# EAGLE schematic Propeller_Development_Slab (EAGLE 6.6.0)
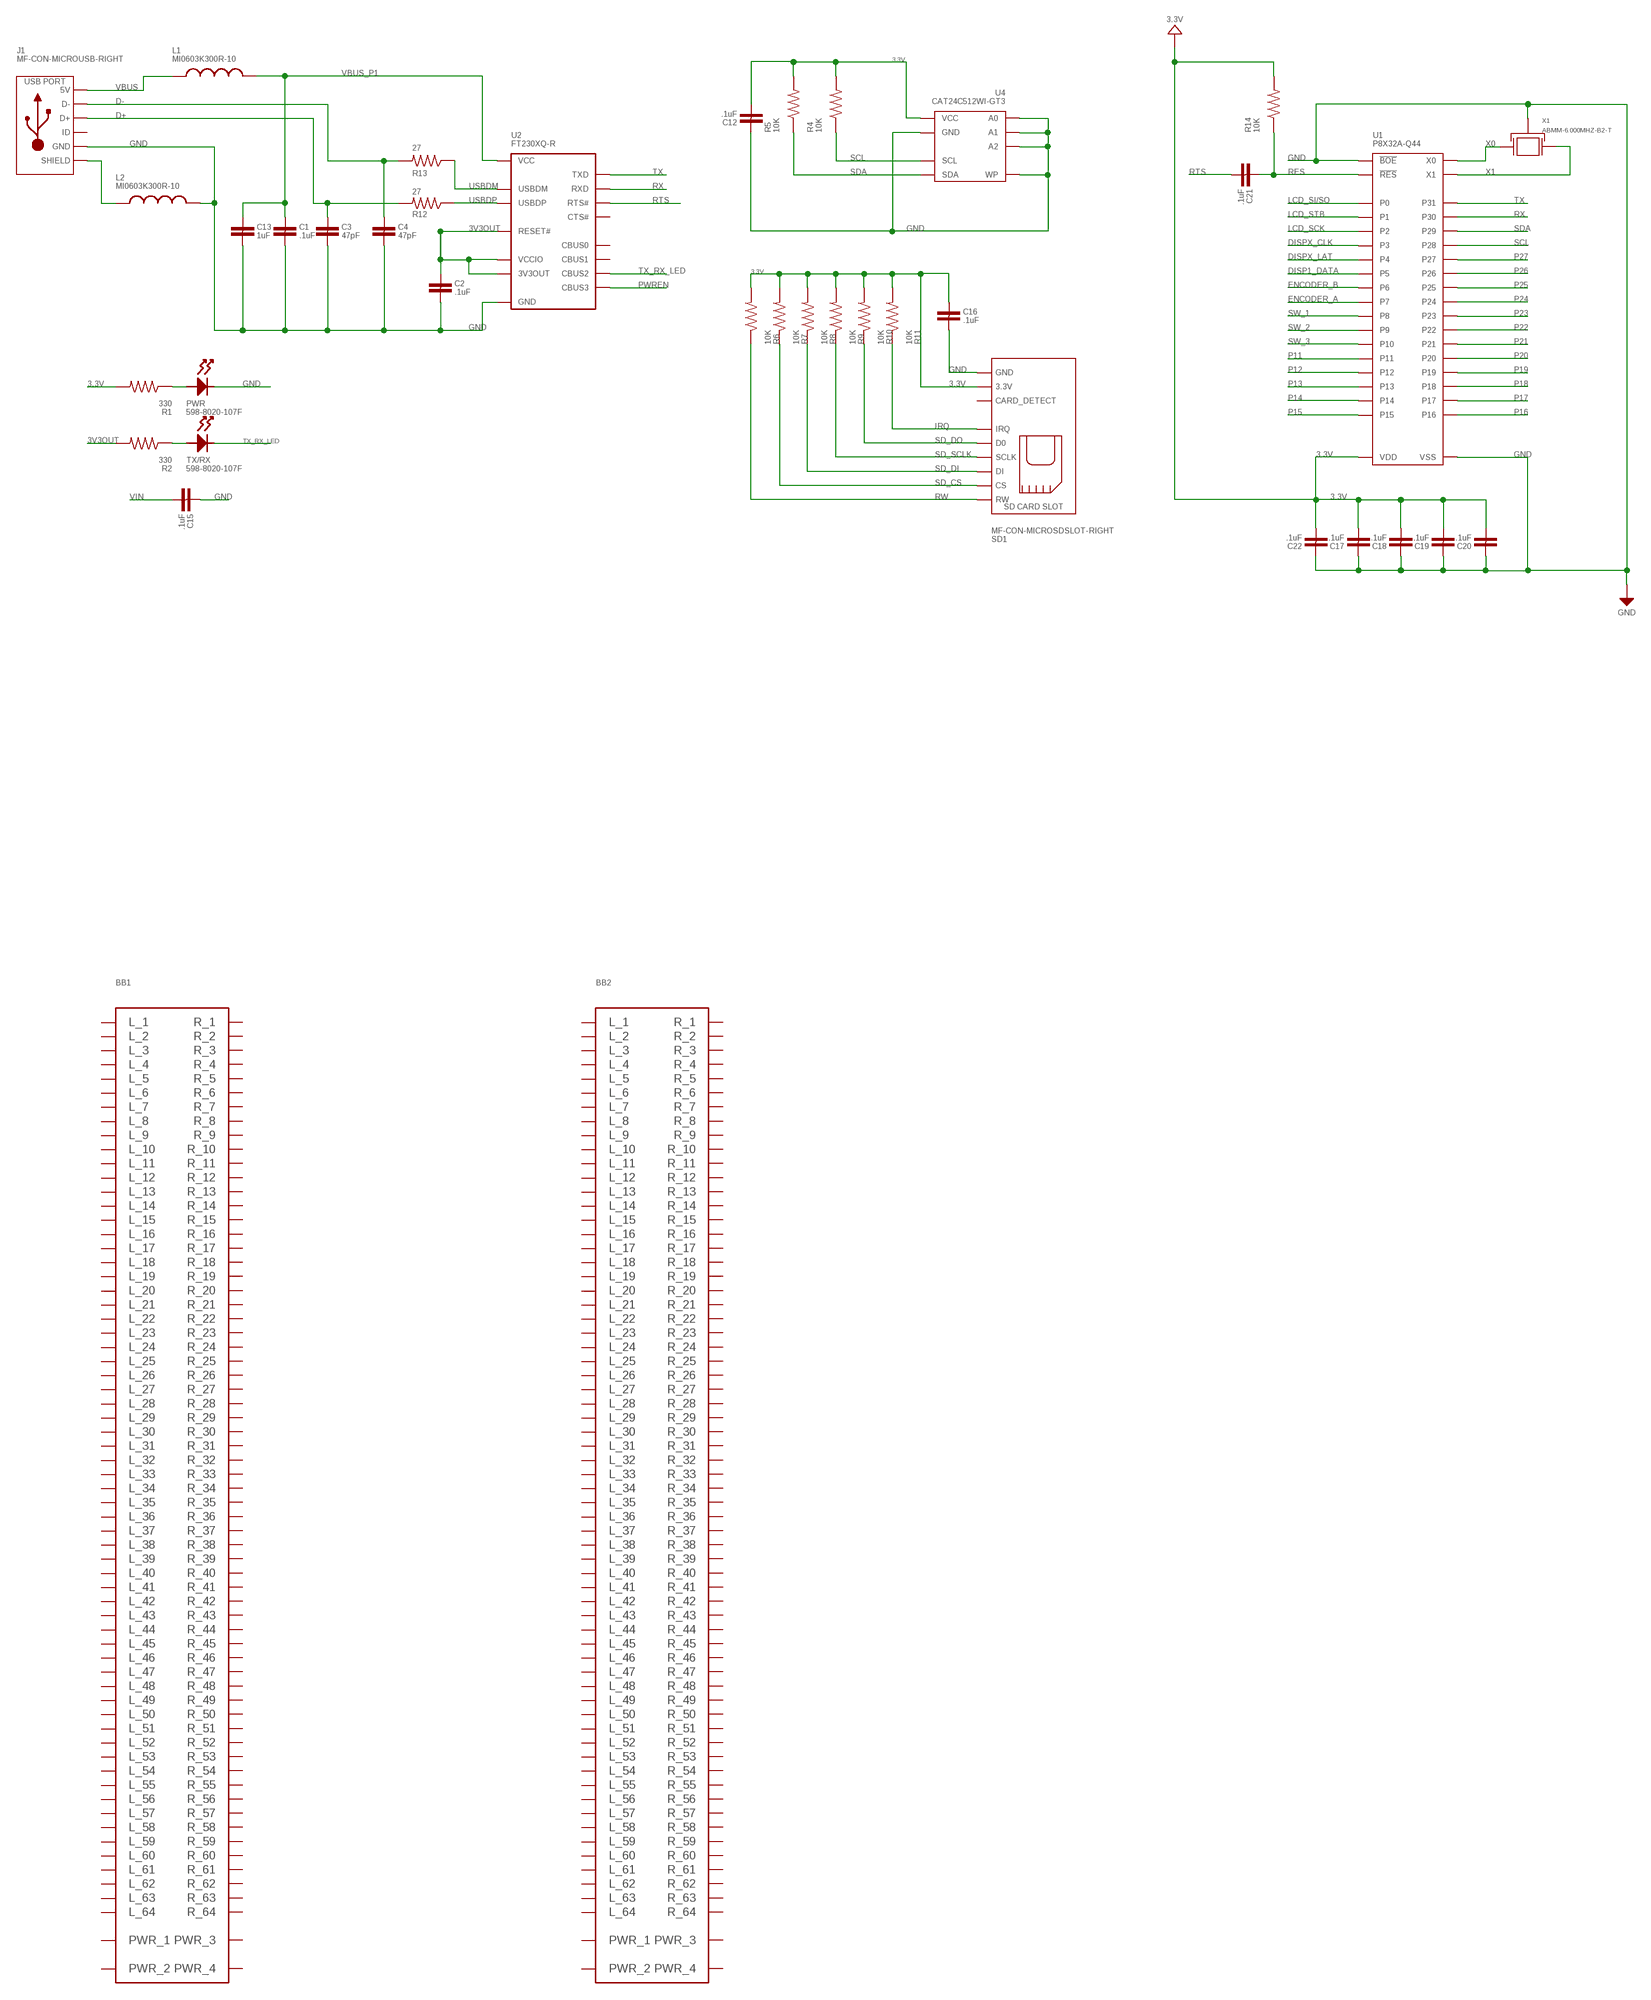
[diagram p0: schematic, sheet 1]

## Parts
BB1  BREADBOARD_0165-4214-7-9010  [0165-4214-7-9010]
BB2  BREADBOARD_0165-4214-7-9010  [0165-4214-7-9010]
C1  .1uF  CAPACITOR_NON_POLAR_0805  [0805]
C2  .1uF  CAPACITOR_NON_POLAR_0805  [0805]
C3  47pF  CAPACITOR_NON_POLAR_0805  [0805]
C4  47pF  CAPACITOR_NON_POLAR_0805  [0805]
C12  .1uF  CAPACITOR_NON_POLAR_0805  [0805]
C13  1uF  CAPACITOR_NON_POLAR_0805  [0805]
C15  .1uF  CAPACITOR_NON_POLAR_0805  [0805]
C16  .1uF  CAPACITOR_NON_POLAR_0805  [0805]
C17  .1uF  CAPACITOR_NON_POLAR_0805  [0805]
C18  .1uF  CAPACITOR_NON_POLAR_0805  [0805]
C19  .1uF  CAPACITOR_NON_POLAR_0805  [0805]
C20  .1uF  CAPACITOR_NON_POLAR_0805  [0805]
C21  .1uF  CAPACITOR_NON_POLAR_0805  [0805]
C22  .1uF  CAPACITOR_NON_POLAR_0805  [0805]
J1  MF-CON-MICROUSB-RIGHT  USB_MICRO_RIGHT  [MICROUSB-RIGHT]
L1  MI0603K300R-10  INDUCTOR_0603  [0603]
L2  MI0603K300R-10  INDUCTOR_0603  [0603]
PWR  598-8020-107F  LED_SINGLE_0805  [LED_0805]
R1  330  RESISTOR_0805  [0805]
R2  330  RESISTOR_0805  [0805]
R4  10K  RESISTOR_0805  [0805]
R5  10K  RESISTOR_0805  [0805]
R6  10K  RESISTOR_0805  [0805]
R7  10K  RESISTOR_0805  [0805]
R8  10K  RESISTOR_0805  [0805]
R9  10K  RESISTOR_0805  [0805]
R10  10K  RESISTOR_0805  [0805]
R11  10K  RESISTOR_0805  [0805]
R12  27  RESISTOR_0805  [0805]
R13  27  RESISTOR_0805  [0805]
R14  10K  RESISTOR_0805  [0805]
SD1  MF-CON-MICROSDSLOT-RIGHT  SD_CARD_SLOT_MICRO_RIGHT  [MICROSDSLOT-RIGHT]
TX/RX  598-8020-107F  LED_SINGLE_0805  [LED_0805]
U1  P8X32A-Q44  [P8X32A_LQFP-44]
U2  FT230XQ-R  FT230XQ  [FT230X_QFN-16]
U4  CAT24C512WI-GT3  EEPROM_I2CSOIC-8_W  [SOIC-8_W]
X1  ABMM-6.000MHZ-B2-T  XTL_7MMX5MM  [7MMX5MM]

## Nets
3.3V: C12.2 C16.1 C17.2 C18.2 C19.2 C20.2 C22.2 R1.2 R4.2 R5.2 R6.2 R7.2 R8.2 R9.2 R10.2 R11.2 R14.2 SD1.PIN4(3.3V) U1.8(VDD) U1.18(VDD) U1.30(VDD) U1.40(VDD) U4.8(VCC)
3V3OUT: C2.1 R2.2 U2.1(VCCIO) U2.8(3V3OUT) U2.9(RESET#)
D+: C3.1 J1.3(D+) R12.2
D-: C4.1 J1.2(D-) R13.2
DISP1_DATA: U1.2(P5)
DISPX_CLK: U1.44(P3)
DISPX_LAT: U1.1(P4)
ENCODER_A: U1.4(P7)
ENCODER_B: U1.3(P6)
GND: C1.2 C2.2 C3.2 C4.2 C12.1 C13.2 C15.1 C16.2 C17.1 C18.1 C19.1 C20.1 C22.1 J1.5(GND) L2.2 PWR.CATHODE SD1.G0(GND) SD1.G1(GND) SD1.PIN6(GND) U1.5(VSS) U1.6(!BOE) U1.17(VSS) U1.27(VSS) U1.39(VSS) U2.3(GND) U2.13(GND) U2.PAD(GND) U4.1(A0) U4.2(A1) U4.3(A2) U4.4(GND) U4.7(WP) X1.P$2(GND) X1.P$4(GND)
IRQ: R11.1 SD1.PIN8(IRQ)
LCD_SCK: U1.43(P2)
LCD_SI/SO: U1.41(P0)
LCD_STB: U1.42(P1)
N$1: PWR.ANODE R1.1
N$2: R2.1 TX/RX.ANODE
N$3: J1.S1(SLD) J1.S2(SLD) J1.S3(SLD) J1.S4(SLD) J1.S5(SLD) J1.S6(SLD) L2.1
P11: U1.12(P11)
P12: U1.13(P12)
P13: U1.14(P13)
P14: U1.15(P14)
P15: U1.16(P15)
P16: U1.19(P16)
P17: U1.20(P17)
P18: U1.21(P18)
P19: U1.22(P19)
P20: U1.23(P20)
P21: U1.24(P21)
P22: U1.25(P22)
P23: U1.26(P23)
P24: U1.31(P24)
P25: U1.32(P25)
P26: U1.33(P26)
P27: U1.34(P27)
PWREN: U2.14(CBUS3)
RES: C21.1 R14.1 U1.7(!RES)
RTS: C21.2 U2.16(RTS#)
RW: R6.1 SD1.PIN1(RW)
RX: U1.37(P30) U2.2(RXD)
SCL: R4.1 U1.35(P28) U4.6(SCL)
SD_CS: R7.1 SD1.PIN2(CS)
SD_DI: R8.1 SD1.PIN3(DI)
SD_DO: R10.1 SD1.PIN7(D0)
SD_SCLK: R9.1 SD1.PIN5(SCLK)
SDA: R5.1 U1.36(P29) U4.5(SDA)
SW_1: U1.9(P8)
SW_2: U1.10(P9)
SW_3: U1.11(P10)
TX: U1.38(P31) U2.15(TXD)
TX_RX_LED: TX/RX.CATHODE U2.5(CBUS2)
USBDM: R13.1 U2.7(USBDM)
USBDP: R12.1 U2.6(USBDP)
VBUS: J1.1(5V) L1.1
VBUS_P1: C1.1 C13.1 L1.2 U2.10(VCC)
VIN: C15.2
X0: U1.29(X0) X1.P$3(X1)
X1: U1.28(X1) X1.P$1(X0)
Unconnected: BB1.L_1 BB1.L_2 BB1.L_3 BB1.L_4 BB1.L_5 BB1.L_6 BB1.L_7 BB1.L_8 BB1.L_9 BB1.L_10 BB1.L_11 BB1.L_12 BB1.L_13 BB1.L_14 BB1.L_15 BB1.L_16 BB1.L_17 BB1.L_18 BB1.L_19 BB1.L_20 BB1.L_21 BB1.L_22 BB1.L_23 BB1.L_24 BB1.L_25 BB1.L_26 BB1.L_27 BB1.L_28 BB1.L_29 BB1.L_30 BB1.L_31 BB1.L_32 BB1.L_33 BB1.L_34 BB1.L_35 BB1.L_36 BB1.L_37 BB1.L_38 BB1.L_39 BB1.L_40 BB1.L_41 BB1.L_42 BB1.L_43 BB1.L_44 BB1.L_45 BB1.L_46 BB1.L_47 BB1.L_48 BB1.L_49 BB1.L_50 BB1.L_51 BB1.L_52 BB1.L_53 BB1.L_54 BB1.L_55 BB1.L_56 BB1.L_57 BB1.L_58 BB1.L_59 BB1.L_60 BB1.L_61 BB1.L_62 BB1.L_63 BB1.L_64 BB1.P1_1(PWR_1) BB1.P1_2(PWR_1) BB1.P1_3(PWR_1) BB1.P1_4(PWR_1) BB1.P1_5(PWR_1) BB1.P1_6(PWR_1) BB1.P1_7(PWR_1) BB1.P1_8(PWR_1) BB1.P1_9(PWR_1) BB1.P1_10(PWR_1) BB1.P2_1(PWR_2) BB1.P2_2(PWR_2) BB1.P2_3(PWR_2) BB1.P2_4(PWR_2) BB1.P2_5(PWR_2) BB1.P2_6(PWR_2) BB1.P2_7(PWR_2) BB1.P2_8(PWR_2) BB1.P2_9(PWR_2) BB1.P2_10(PWR_2) BB1.P3_1(PWR_3) BB1.P3_2(PWR_3) BB1.P3_3(PWR_3) BB1.P3_4(PWR_3) BB1.P3_5(PWR_3) BB1.P3_6(PWR_3) BB1.P3_7(PWR_3) BB1.P3_8(PWR_3) BB1.P3_9(PWR_3) BB1.P3_10(PWR_3) BB1.P4_1(PWR_4) BB1.P4_2(PWR_4) BB1.P4_3(PWR_4) BB1.P4_4(PWR_4) BB1.P4_5(PWR_4) BB1.P4_6(PWR_4) BB1.P4_7(PWR_4) BB1.P4_8(PWR_4) BB1.P4_9(PWR_4) BB1.P4_10(PWR_4) BB1.R_1 BB1.R_2 BB1.R_3 BB1.R_4 BB1.R_5 BB1.R_6 BB1.R_7 BB1.R_8 BB1.R_9 BB1.R_10 BB1.R_11 BB1.R_12 BB1.R_13 BB1.R_14 BB1.R_15 BB1.R_16 BB1.R_17 BB1.R_18 BB1.R_19 BB1.R_20 BB1.R_21 BB1.R_22 BB1.R_23 BB1.R_24 BB1.R_25 BB1.R_26 BB1.R_27 BB1.R_28 BB1.R_29 BB1.R_30 BB1.R_31 BB1.R_32 BB1.R_33 BB1.R_34 BB1.R_35 BB1.R_36 BB1.R_37 BB1.R_38 BB1.R_39 BB1.R_40 BB1.R_41 BB1.R_42 BB1.R_43 BB1.R_44 BB1.R_45 BB1.R_46 BB1.R_47 BB1.R_48 BB1.R_49 BB1.R_50 BB1.R_51 BB1.R_52 BB1.R_53 BB1.R_54 BB1.R_55 BB1.R_56 BB1.R_57 BB1.R_58 BB1.R_59 BB1.R_60 BB1.R_61 BB1.R_62 BB1.R_63 BB1.R_64 BB2.L_1 BB2.L_2 BB2.L_3 BB2.L_4 BB2.L_5 BB2.L_6 BB2.L_7 BB2.L_8 BB2.L_9 BB2.L_10 BB2.L_11 BB2.L_12 BB2.L_13 BB2.L_14 BB2.L_15 BB2.L_16 BB2.L_17 BB2.L_18 BB2.L_19 BB2.L_20 BB2.L_21 BB2.L_22 BB2.L_23 BB2.L_24 BB2.L_25 BB2.L_26 BB2.L_27 BB2.L_28 BB2.L_29 BB2.L_30 BB2.L_31 BB2.L_32 BB2.L_33 BB2.L_34 BB2.L_35 BB2.L_36 BB2.L_37 BB2.L_38 BB2.L_39 BB2.L_40 BB2.L_41 BB2.L_42 BB2.L_43 BB2.L_44 BB2.L_45 BB2.L_46 BB2.L_47 BB2.L_48 BB2.L_49 BB2.L_50 BB2.L_51 BB2.L_52 BB2.L_53 BB2.L_54 BB2.L_55 BB2.L_56 BB2.L_57 BB2.L_58 BB2.L_59 BB2.L_60 BB2.L_61 BB2.L_62 BB2.L_63 BB2.L_64 BB2.P1_1(PWR_1) BB2.P1_2(PWR_1) BB2.P1_3(PWR_1) BB2.P1_4(PWR_1) BB2.P1_5(PWR_1) BB2.P1_6(PWR_1) BB2.P1_7(PWR_1) BB2.P1_8(PWR_1) BB2.P1_9(PWR_1) BB2.P1_10(PWR_1) BB2.P2_1(PWR_2) BB2.P2_2(PWR_2) BB2.P2_3(PWR_2) BB2.P2_4(PWR_2) BB2.P2_5(PWR_2) BB2.P2_6(PWR_2) BB2.P2_7(PWR_2) BB2.P2_8(PWR_2) BB2.P2_9(PWR_2) BB2.P2_10(PWR_2) BB2.P3_1(PWR_3) BB2.P3_2(PWR_3) BB2.P3_3(PWR_3) BB2.P3_4(PWR_3) BB2.P3_5(PWR_3) BB2.P3_6(PWR_3) BB2.P3_7(PWR_3) BB2.P3_8(PWR_3) BB2.P3_9(PWR_3) BB2.P3_10(PWR_3) BB2.P4_1(PWR_4) BB2.P4_2(PWR_4) BB2.P4_3(PWR_4) BB2.P4_4(PWR_4) BB2.P4_5(PWR_4) BB2.P4_6(PWR_4) BB2.P4_7(PWR_4) BB2.P4_8(PWR_4) BB2.P4_9(PWR_4) BB2.P4_10(PWR_4) BB2.R_1 BB2.R_2 BB2.R_3 BB2.R_4 BB2.R_5 BB2.R_6 BB2.R_7 BB2.R_8 BB2.R_9 BB2.R_10 BB2.R_11 BB2.R_12 BB2.R_13 BB2.R_14 BB2.R_15 BB2.R_16 BB2.R_17 BB2.R_18 BB2.R_19 BB2.R_20 BB2.R_21 BB2.R_22 BB2.R_23 BB2.R_24 BB2.R_25 BB2.R_26 BB2.R_27 BB2.R_28 BB2.R_29 BB2.R_30 BB2.R_31 BB2.R_32 BB2.R_33 BB2.R_34 BB2.R_35 BB2.R_36 BB2.R_37 BB2.R_38 BB2.R_39 BB2.R_40 BB2.R_41 BB2.R_42 BB2.R_43 BB2.R_44 BB2.R_45 BB2.R_46 BB2.R_47 BB2.R_48 BB2.R_49 BB2.R_50 BB2.R_51 BB2.R_52 BB2.R_53 BB2.R_54 BB2.R_55 BB2.R_56 BB2.R_57 BB2.R_58 BB2.R_59 BB2.R_60 BB2.R_61 BB2.R_62 BB2.R_63 BB2.R_64 J1.4(ID) SD1.PIN9(CRD_DTCT) SD1.PIN10(CRD_DTCT) U2.4(CTS#) U2.11(CBUS1) U2.12(CBUS0)

## Library data of the parts
BB1 BB2 = PP_Connectors:BREADBOARD
C1-C4 C12 C13 C15-C22 = PP_Passives:CAPACITOR_NON_POLAR: Capacitor Non Polarized
J1 = MF_Connectors:USB: Library: MF_Connectors Description: 5 Pin USB Connectors. SLD is the shield connection. Usually tied to ground through a small ferrite bead.
L1 L2 = PP_Passives:INDUCTOR: Inductors
PWR TX/RX = PP_LED:LED_SINGLE
R1 R2 R4-R14 = PP_Passives:RESISTOR: Resistors
SD1 = MF_Connectors:SD_CARD_SLOT: Library: MF_Connectors Description: SD Card Connector
U1 = PP_DigitalIC:P8X32A: Manufacturer Part #: P8X32A Manufacturer: Parallax Description: 32-bit Microcontrollers - MCU Propeller Chip
U2 = PP_DigitalIC:FT230X: Manufacturer Part #: FT230X Manufacturer: FTDI Description: USB Interface IC USB to Basic Serial UART IC
U4 = PP_DigitalIC:EEPROM_I2C
X1 = MF_Frequency_Control:XTL: Library: MF_Frequency_Control Description: Device for Cyrstal Oscillators. Manufacture part number (MFG#) can be added via Attributes.